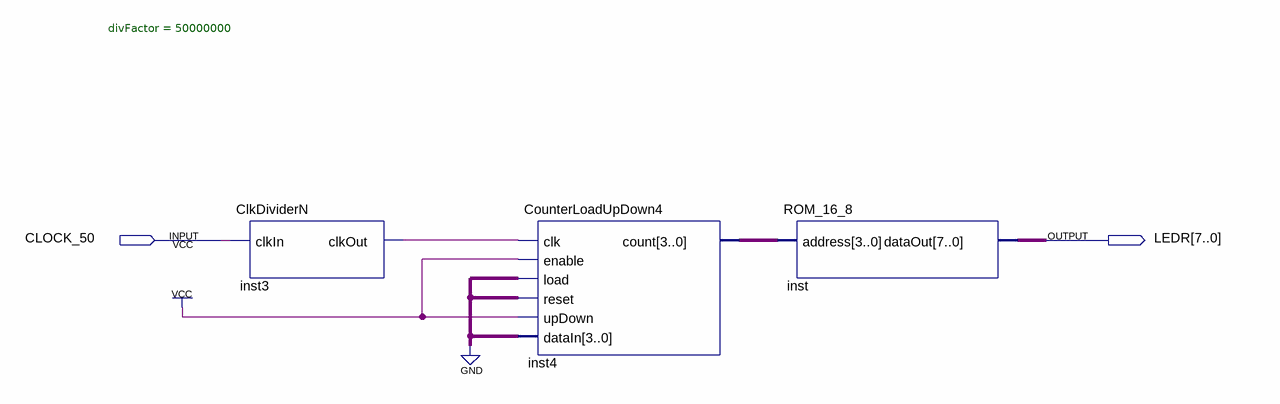
[diagram p0: schematic sheet]
// Quartus schematic ROM_Demo_Counter.bdf as structural Verilog: 3 symbols, 2 pins
module ROM_Demo_Counter (
  input  CLOCK_50,
  output [7:0] LEDR
);

  wire inst3_clkout;
  wire [3:0] inst4_count;

  ClkDividerN #(.divFactor(50000000)) inst3 (.clkIn(CLOCK_50), .clkOut(inst3_clkout));
  CounterLoadUpDown4 inst4 (
    .clk(inst3_clkout), .enable(1'b1), .load(4'b0000), .reset(4'b0000), .upDown(1'b1), .dataIn(4'b0000),
    .count(inst4_count));
  ROM_16_8 inst (.address(inst4_count), .dataOut(LEDR));
endmodule
